# EAGLE design esp (EAGLE 8.0.1)
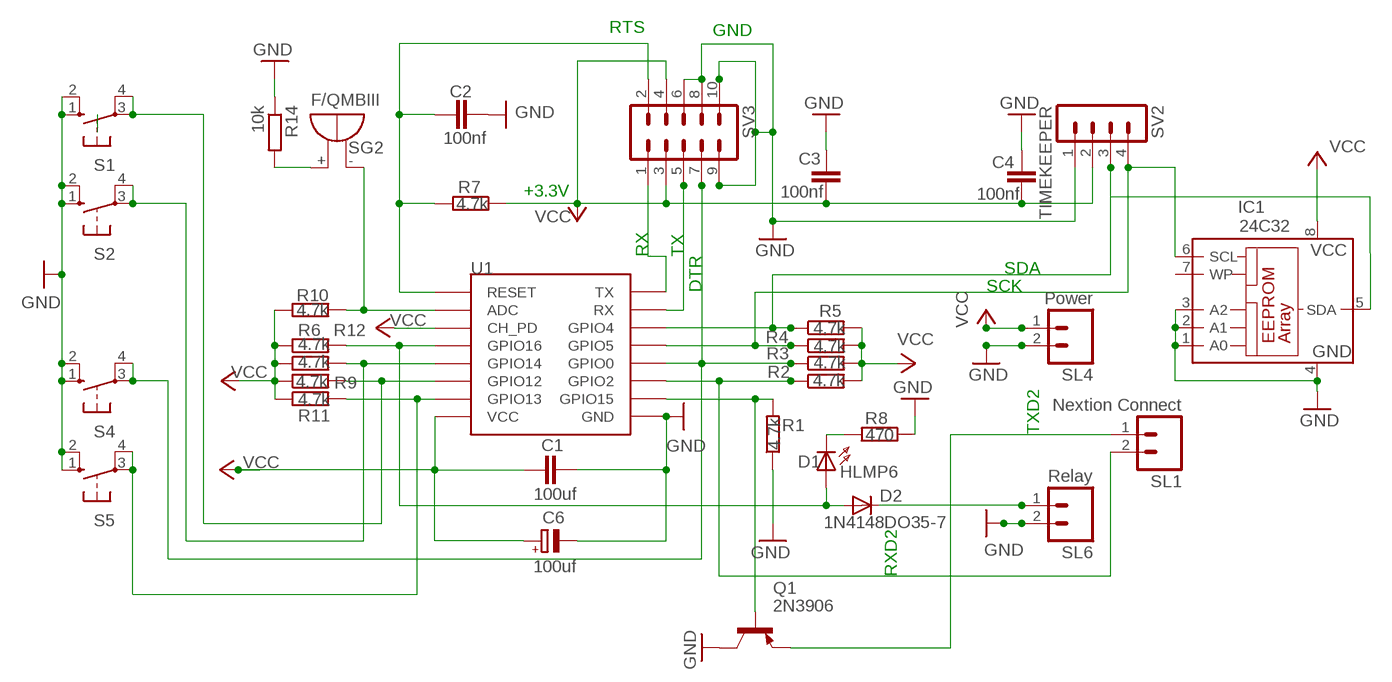
[diagram p0: schematic, sheet 1]

## Parts
C1  100uf  C  [C0805]
C2  100nf  C  [C0805]
C3  100nf  C  [C0805]
C4  100nf  C  [C0805]
C6  100uf  CPOL-EUE5-10.5  [E5-10,5]
D1  HLMP6  [HLMP6]
D2  1N4148DO35-7  [DO35-7]
IC1  24C32  24C04CSN  [SO-08]
Q1  2N3906  [TO92]
R1  4.7k  R  [R0805]
R2  4.7k  R  [R0805]
R3  4.7k  R  [R0805]
R4  4.7k  R  [R0805]
R5  4.7k  R  [R0805]
R6  4.7k  R  [R0805]
R7  4.7k  R  [R0805]
R8  470  R  [R0805]
R9  4.7k  R  [R0805]
R10  4.7k  R  [R0805]
R11  4.7k  R  [R0805]
R12  4.7k  R  [R0805]
R14  10k  R  [R0805]
S1  10-XX  [B3F-10XX]
S2  10-XX  [B3F-10XX]
S4  10-XX  [B3F-10XX]
S5  10-XX  [B3F-10XX]
SG2  F/QMBIII  [F/QMBIII]
SL1  Nextion Connect  M02  [02P]
SL4  Power  M02  [02P]
SL6  Relay  M02  [02P]
SV2  TIMEKEEPER  MA04-1  [MA04-1]
SV3  MA05-2  [MA05-2]
U1  ESP12SMD  [ESP12-SMD]

## Nets
ADC: R10.2 SG2.-(+) U1.ADC
DTR: R3.1 S4.3(P) S4.4(P1) SV3.7 U1.GPIO0
GND [supply]: C1.1 C2.1 C3.2 C4.2 C6.- IC1.1(A0) IC1.2(A1) IC1.3(A2) IC1.4(GND) Q1.1(C) R1.1 R8.1 R14.1 S1.1(S) S1.2(S1) S2.1(S) S2.2(S1) S4.1(S) S4.2(S1) S5.1(S) S5.2(S1) SL4.2 SL6.2 SV2.1 SV3.6 SV3.8 SV3.9 SV3.10 U1.GND
GPIO02: R11.2 S5.3(P) S5.4(P1) U1.GPIO13
GPIO12: R9.2 S1.3(P) S1.4(P1) U1.GPIO12
GPIO14: R12.2 S2.3(P) S2.4(P1) U1.GPIO14
GPIO15: Q1.2(B) R1.2 U1.GPIO15
GPIO16: D1.A D2.A R6.2 U1.GPIO16
N$1: D2.C SL6.1
N$2: Q1.3(E) SL1.1
N$3: R14.2 SG2.+(-)
N$11: D1.K R8.2
RTS: C2.2 R7.2 SV3.2 U1.RESET
RX: SV3.1 U1.TXD0(TX)
RXD2: R2.1 SL1.2 U1.GPIO2
SCK: IC1.6(SCL) R4.1 SV2.4 U1.GPIO5
SDA: IC1.5(SDA) R5.1 SV2.3 U1.GPIO4
TX: SV3.5 U1.RXD0(RX)
VCC [supply]: C1.2 C3.1 C4.1 C6.+ IC1.8(VCC) R2.2 R3.2 R4.2 R5.2 R6.1 R7.1 R9.1 R10.1 R11.1 R12.1 SL4.1 SV2.2 SV3.3 SV3.4 U1.CH_PD U1.VCC
Unconnected: IC1.7(WP)

## Notes on the sheet
- RTS | GND
- +3.3V
- RX | TX
- SDA
- DTR | SCK
- TXD2
- RXD2

## Library data of the parts
C1-C4 = eagle-ltspice:C: CAPACITOR, European symbol; SPICEMODEL: NONE; SPICEPREFIX: C
C6 = rcl:CPOL-EU: POLARIZED CAPACITOR, European symbol
D1 = display-hp:HLMP6: LED 2mm horizontal; MF: AGILENT TECHNOLOGIES; MPN: HLMP-6500; OC_FARNELL: 1652490; OC_NEWARK: 40K0088
D2 = diode:1N4148: DIODE high speed (Philips)
IC1 = microchip-3:24C*: Serial EEPROM 1 K/2 K/4 K
Q1 = transistor-pnp:2N3906: PNP Transistor
R1-R12 R14 = eagle-ltspice:R: RESISTOR, European symbol; SPICEMODEL: NONE; SPICEPREFIX: R
S1 S2 S4 S5 = switch-omron:10-XX: OMRON SWITCH; MPN: B3F-1000; OC_FARNELL: 176432; OC_NEWARK: 36M3542
SG2 = buzzer:F/QMBIII: BUZZER Source: Buerklin; OC_FARNELL: unknown; OC_NEWARK: unknown
SL1 SL4 SL6 = con-amp-quick:M02: AMP QUICK CONNECTOR; OC_FARNELL: unknown; OC_NEWARK: unknown
SV2 = con-lstb:MA04-1: PIN HEADER; OC_FARNELL: unknown; OC_NEWARK: unknown
SV3 = con-lstb:MA05-2: PIN HEADER; OC_FARNELL: unknown; OC_NEWARK: unknown
U1 = esp8266modules:ESP12: ESP8266 Wifi module 12

## Net classes
1 supply: width 0.813 mm

## Board
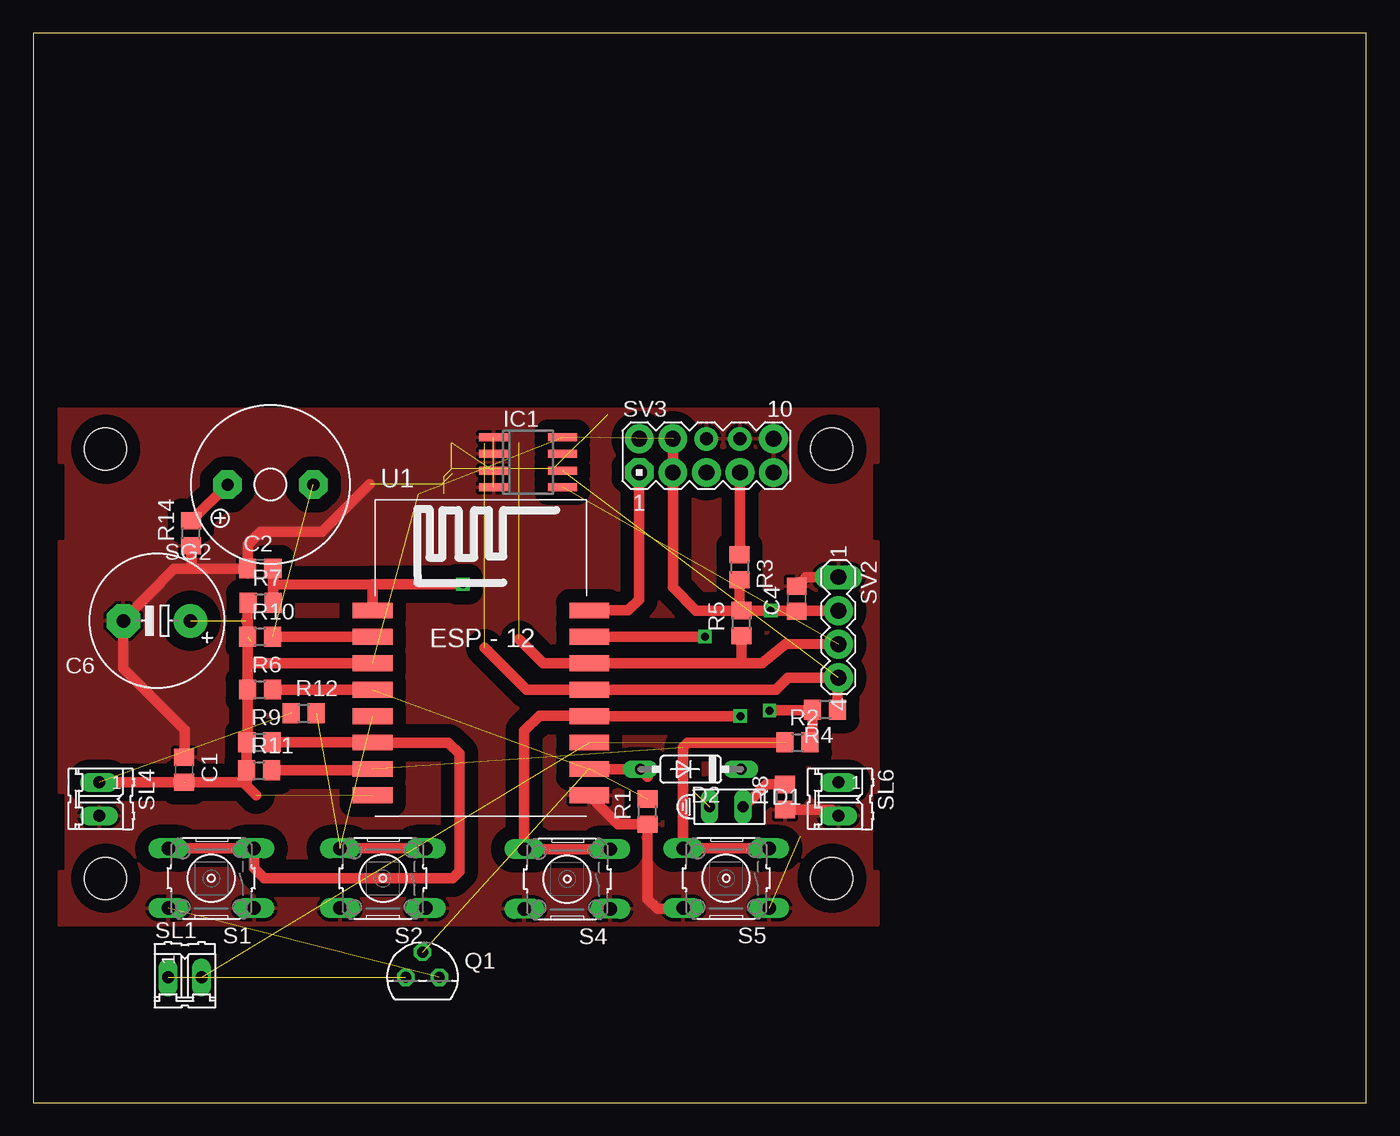
[diagram p1: board, top side]
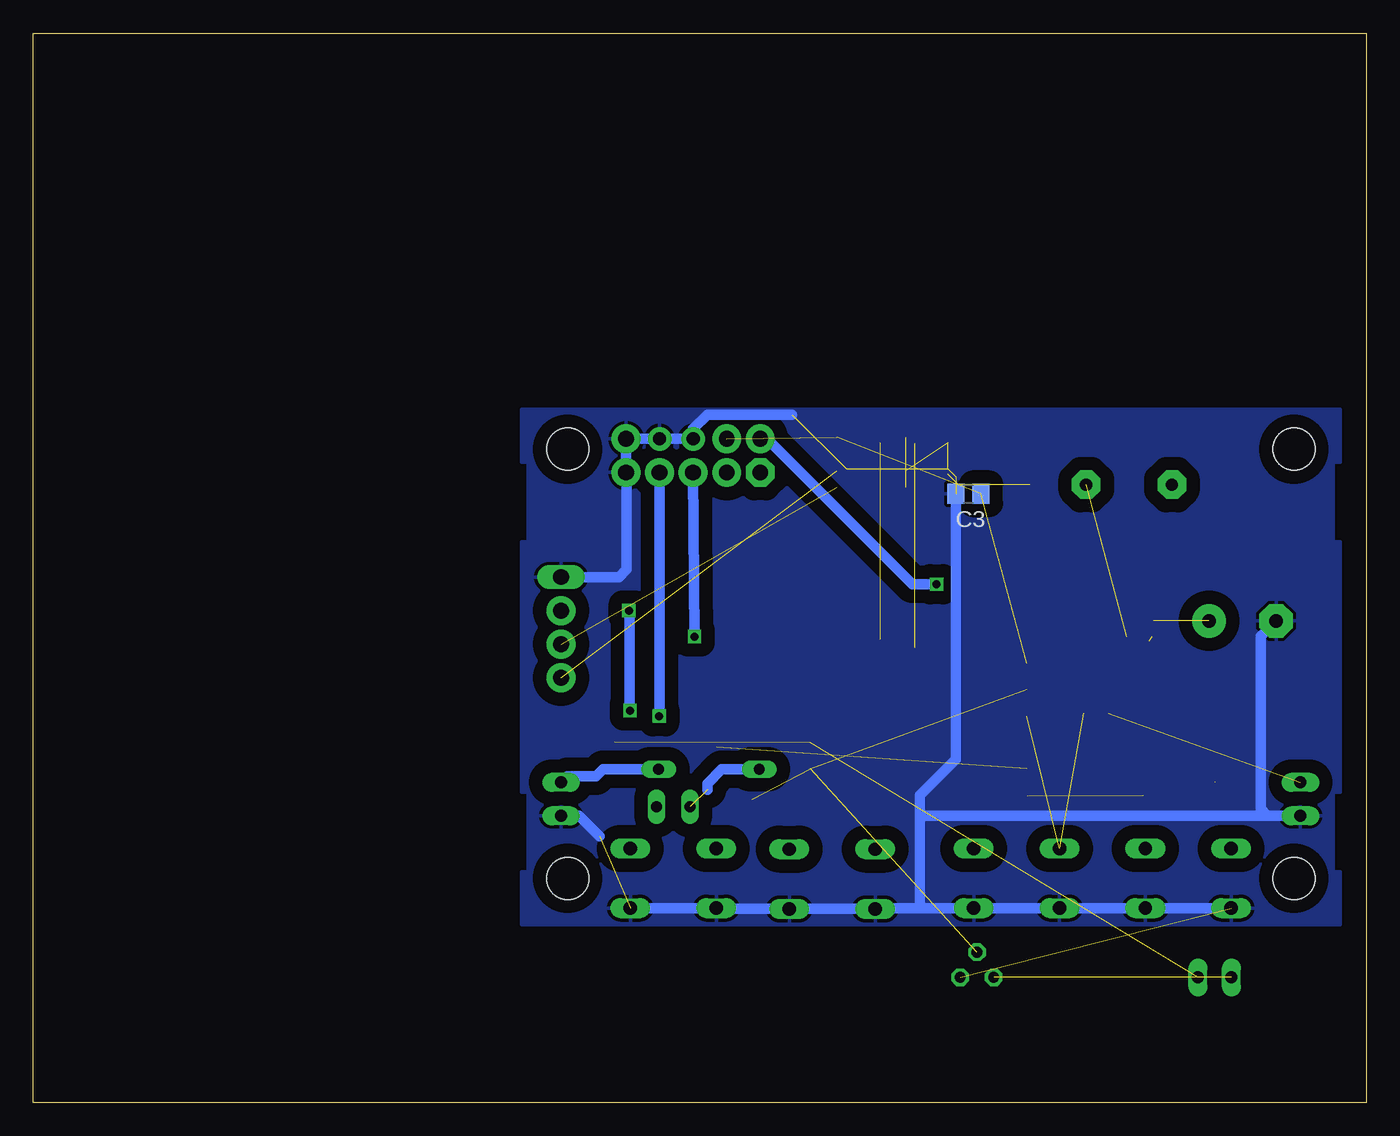
[diagram p2: board, bottom side, seen from below]

Size 101 x 81 mm. Coordinates in mm from the lower left corner, seen from the top.
Outline: 0,0 101,0 101,81 0,81 0,0
Copper layers (1*16): Top 0.035mm / dielectric 1.5mm / Bottom 0.035mm
Design rules "default *": minimum track width 12mil, minimum drill 0.5mm, track to track 8mil, track to pad 8mil, pad to pad 8mil, via to via 8mil, smd to smd 8mil, copper to edge 40mil, drill to drill 8mil, minimum pad ring 10mil, minimum via ring 8mil, stop-mask expansion 0mil, vias tented up to drill 0mil, thermal gap 10mil
Holes 3.2 mm at 5.5,17 60.5,17 60.5,49.5 5.5,49.5
tKeepout: 20 lines

### Footprints (pad centres in the part's own frame; a part is rotated, then mirrored left to right if it is on the bottom)
C0805 = smd 1.3 x 1.5: 1 -0.95,0; 2 0.95,0
E5-10,5 = drill 1.016 pad 2.54: + -2.54,0 | drill 1.016 pad 2.54 octagon: - 2.54,0
HLMP6 = drill 0.813 long: A -1.27,0; K 1.27,0
DO35-7 = drill 0.813 long: A 3.81,0; C -3.81,0
SO-08 = smd 0.6 x 2.2: 1 -1.905,-2.6; 2 -0.635,-2.6; 3 0.635,-2.6; 4 1.905,-2.6; 5 1.905,2.6; 6 0.635,2.6; 7 -0.635,2.6; 8 -1.905,2.6
TO92 = drill 0.813 octagon: 1 1.27,0; 2 0,1.905; 3 -1.27,0
R0805 = smd 1.3 x 1.5: 1 -0.95,0; 2 0.95,0
B3F-10XX = drill 1.016 long: 1 -3.251,2.261; 2 3.251,2.261; 3 -3.251,-2.261; 4 3.251,-2.261
F/QMBIII = drill 0.914 pad 2.159 octagon: + 3.251,0; - -3.251,0
02P = drill 0.914 long: 1 -1.27,0; 2 1.27,0
MA04-1 = drill 1.2 long: 1 -3.81,0 | drill 1.2 pad 2.184: 2 -1.27,0; 3 1.27,0; 4 3.81,0
MA05-2 = drill 1.2 pad 2.184 octagon: 1 -5.08,-1.27 | drill 1.2 pad 2.184: 2 -5.08,1.27; 3 -2.54,-1.27; 4 -2.54,1.27; 5 0,-1.27; 7 2.54,-1.27; 9 5.08,-1.27; 10 5.08,1.27 | drill 1 pad 1.778: 6 0,1.27; 8 2.54,1.27
ESP12-SMD = smd 3 x 1.2: ADC -8.3,3.8; CH_PD -8.3,1.8; GND 8.1,-8.2; GPIO0 8.1,-2.2; GPIO2 8.1,-4.2; GPIO4 8.1,1.8; GPIO5 8.1,-0.2; GPIO12 -8.3,-4.2; GPIO13 -8.3,-6.2; GPIO14 -8.3,-2.2; GPIO15 8.1,-6.2; GPIO16 -8.3,-0.2; RESET -8.3,5.8; RXD0 8.1,3.8; TXD0 8.1,5.8; VCC -8.3,-8.2

### Placement (x,y rotation side)
C1  11.45,25.23 270 top
C2  17.22,40.45 0 top
C3  30.14,46.11 180 bottom
C4  57.85,38.17 90 top
C6  9.39,36.5 180 top
D1  52.5,22.42 0 top
D2  49.81,25.25 180 top
IC1  37.5,48.5 270 top
Q1  29.5,9.5 0 top
R1  46.55,22.05 90 top
R2  57.91,27.29 0 top
R3  53.51,40.54 270 top
R4  59.99,29.77 180 top
R5  53.66,36.32 90 top
R6  17.2,31.29 0 top
R7  17.24,37.86 0 top
R8  56.97,23.15 90 top
R9  17.15,27.3 0 top
R10  17.2,35.3 0 top
R11  17.13,25.17 0 top
R12  20.5,29.5 0 top
R14  11.97,43.12 90 top
S1  13.5,17 180 top
S2  26.5,17 180 top
S4  40.46,16.94 180 top
S5  52.5,17 180 top
SG2  17.98,46.81 180 top
SL1  11.5,9.5 0 top
SL4  5,23 270 top
SL6  61,23 270 top
SV2  61,36 270 top
SV3  51,49 0 top
U1  34.02,31.48 0 top

### Tracks (layer width: path | path; a pad name or v marks a point on that pad's centre or on a via)
ADC  (1 unrouted)
  Top 0.813: R10.2 25.7,35.3 U1.ADC
DTR  (via drill 0.6)
  Top 0.813: S4.3 S4.4 | 36.58,19.2 S4.4 | v53.57,29.28 U1.GPIO0 42.09,29.31 38.35,29.31 37.21,28.17 S4.4 | SV3.7 53.54,41.52 R3.1
  Bottom 0.813: SV3.7 53.54,29.28 v53.57,29.28
GND  (13 unrouted)
  Top 0.813: 42.1,23.26 U1.GND | 42.14,23.3 U1.GND | 12.02,40.45 C2.1 16.25,40.47 16.25,42.25 17.25,43.25 21.9,43.25 25.5,46.85 | 12.02,40.45 10.68,40.45 C6.- 6.85,32.89 11.48,28.26 11.48,26.21 C1.1 | 12.02,40.45 R14.1 | SV2.1 58.54,39.81 C4.2 | U1.GND 42.15,23.31 | U1.GND 44.3,21.1 R1.1 46.56,15.78 46.56,15.43 47.31,14.68 49.19,14.68 S5.2 | R8.1 60.48,22.2 SL6.2
  Bottom 0.813: 51,50.35 SV3.6 | SV3.6 SV3.8 SV3.10 SV3.9 arc90 56.05,47.7 56.05,40.39 56.63,39.81 SV2.1 | 33.81,14.74 S2.1 S2.2 S1.1 S1.2 10.23,14.72 | 33.81,14.74 37.15,14.74 S4.2 S4.1 49.19,14.68 S5.2 S5.1 | 6.87,36.48 C6.- 8.02,35.33 8.02,22.25 7.5,21.73 | C3.2 31.09,26.02 33.82,23.29 33.82,21.68 | 33.82,21.68 33.82,14.75 33.81,14.74 | SL4.2 7.5,21.73 | 7.5,21.73 33.77,21.73 33.82,21.68 | SV3.6 51,51.04 49.93,52.11 43.51,52.11 | 58.1,20.17 59.66,21.73 SL6.2
  pour Bottom (isolate 1.016): 2.04,13.55 2,13.55 2,17.5 2.5,17.5 2.5,23.5 2,23.5 2,42.5 2.5,42.5 2.5,48.5 2,48.5 2,52.5 64,52.5 64,48.5 63.5,48.5 63.5,42.5 64,42.5 64,23.5 63.5,23.5 63.5,17.5 64,17.5 64,13.5 2,13.5
  pour Top (isolate 1.016): 2,13.5 2,17.5 2.5,17.5 2.5,23.5 2,23.5 2,42.5 2.5,42.5 2.5,48.5 2,48.5 2,52.5 64,52.5 64,48.5 63.5,48.5 63.5,42.5 64,42.5 64,23.5 63.5,23.5 63.5,17.5 64,17.5 64,13.5
GPIO02  (1 unrouted)
  Top 0.813: S5.3 S5.4 49.25,26.94 49.59,27.28 56.95,27.28 | R11.2 25.61,25.17 U1.GPIO13
GPIO12
  Top 0.813: U1.GPIO12 25.7,27.3 | R9.2 25.72,27.3 U1.GPIO12 | 25.74,27.3 U1.GPIO12 | S1.4 S1.3 16.75,17.75 17.51,16.99 31.77,16.99 32.3,17.52 32.3,26.42 31.45,27.27 U1.GPIO12
GPIO14  (2 unrouted)
  Top 0.813: S2.3 S2.4
GPIO15  (2 unrouted)
GPIO16  (2 unrouted)
  Top 0.813: 42.15,25.25 D2.A 46.55,24.7 | R6.2 U1.GPIO16
  Bottom 0.813: D2.A 48.84,25.25 49.93,24.16 49.93,23.72
N$1
  Bottom 0.813: D2.C 57.83,25.25 58.37,24.71 60.51,24.71 SL6.1
N$2  (1 unrouted)
N$3
  Top 0.813: R14.2 SG2.+
N$11
  Top 0.813: D1.K 53.85,22.42 55.54,24.11 R8.2
RTS  (via drill 0.6)
  Top 0.813: 25.64,37.36 U1.RESET 25.71,39.26 | 18.18,39.23 R7.2 | 18.18,39.23 C2.2 | 25.71,39.26 18.18,39.23 | 25.71,39.26 v32.56,39.26 | v32.56,39.26 | v32.56,39.26 v32.57,39.27
  Bottom 0.813: v32.56,39.26 34.41,39.26 45.42,50.27 SV3.2
RX
  Top 0.813: U1.TXD0 45.08,37.28 45.9,38.1 45.9,46.21 SV3.1
RXD2  (2 unrouted)
  Top 0.813: U1.GPIO2
SCK  (2 unrouted)
  Top 0.813: 34.2,34.45 37.37,31.28 U1.GPIO5 56.29,31.28 57.18,32.17 60.98,32.17 SV2.4 | 60.95,32.14 SV2.4 | R4.1 60.94,32.13 SV2.4
SDA  (2 unrouted)
  Top 0.813: 42.14,33.3 arc90 U1.GPIO4 | U1.GPIO4 42.05,33.35 | U1.GPIO4 38.62,33.28 36.8,35.1 | 53,33.28 U1.GPIO4 | 53.73,33.28 53,33.28 | 53.73,33.28 55.22,33.28 57.02,34.75 SV2.3 | 53.01,33.29 53,33.28 | R5.1 53.66,33.35 53.73,33.28
TX  (via drill 0.6)
  Top 0.813: U1.RXD0 50.88,35.28 v50.9,35.3
  Bottom 0.813: v50.9,35.3 SV3.5
VCC  (via drill 0.6)  (8 unrouted)
  Top 0.813: 16.25,33.28 16.25,34.72 | 16.25,33.28 R6.1 16.25,27.35 R9.1 16.2,26.78 | 16.25,36.6 16.25,34.72 | 16.25,36.6 16.25,37.32 R7.1 | 16.48,34.95 16.25,34.72 | U1.CH_PD 16.25,33.28 | 16.2,26.78 16.2,25.19 R11.1 16.2,25.15 16.2,24 | 16.15,36.5 16.25,36.6 | 16.2,24 16.92,23.28 | 16.19,26.77 16.2,26.78 | R5.2 v55.87,37.27 SV2.2 | R5.2 50.23,37.27 48.46,39.04 SV3.3 SV3.4 | R5.2 | R5.2 | R5.2 56.36,37.27 C4.1 | R2.2 59.04,27.47 R4.2 58.98,29.71 v55.77,29.71 v55.78,29.7 | 11.49,24.27 SL4.1 | 11.49,24.27 15.93,24.27 16.2,24 | 11.48,24.28 11.49,24.27 | R3.2 53.51,37.42 R5.2 | 25.7,23.26 U1.VCC
  Bottom 0.813: v55.78,29.7 55.83,29.75 55.83,37.27 v55.87,37.27 | C3.1